# EAGLE design osh4000_breakout (EAGLE 6.6.0)
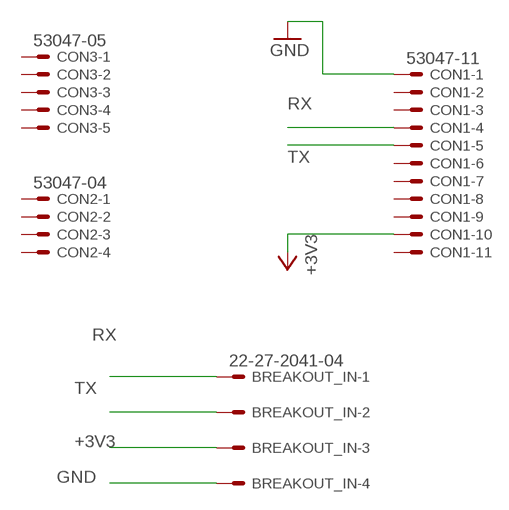
[diagram p0: schematic, sheet 1]

## Parts
BREAKOUT_IN  22-27-2041-04  [6410-04]
CON1  53047-11  [53047-11]
CON2  53047-04  [53047-04]
CON3  53047-05  [53047-05]

## Nets
+3V3: BREAKOUT_IN.3 CON1.10
GND: BREAKOUT_IN.4 CON1.1
RX: BREAKOUT_IN.1 CON1.4
TX: BREAKOUT_IN.2 CON1.5
Unconnected: CON1.2 CON1.3 CON1.6 CON1.7 CON1.8 CON1.9 CON1.11 CON2.1 CON2.2 CON2.3 CON2.4 CON3.1 CON3.2 CON3.3 CON3.4 CON3.5

## Library data of the parts
BREAKOUT_IN = con-molex:22-?-04: CONNECTOR wire to board 2.54 mm (.1 inch) pitch header; OC_FARNELL: unknown; OC_NEWARK: unknown
CON1 = con-molex:53?-11: CONNECTOR wire to board 1.25 mm (.049 inch) pitch header; MF: WALDOM/MOLEX; MPN: 53047-1110; OC_FARNELL: unknown; OC_NEWARK: 18M8168
CON2 = con-molex:53?-04: CONNECTOR wire to board 1.25 mm (.049 inch) pitch header; MF: WALDOM/MOLEX; MPN: 53047-0410; OC_FARNELL: 9733060; OC_NEWARK: 38C9900
CON3 = con-molex:53?-05: CONNECTOR wire to board 1.25 mm (.049 inch) pitch header; MF: MOLEX; MPN: 53047-0510; OC_FARNELL: 9732861; OC_NEWARK: 38C9901

## Net classes
0 default: clearance 0.705 mm

## Board
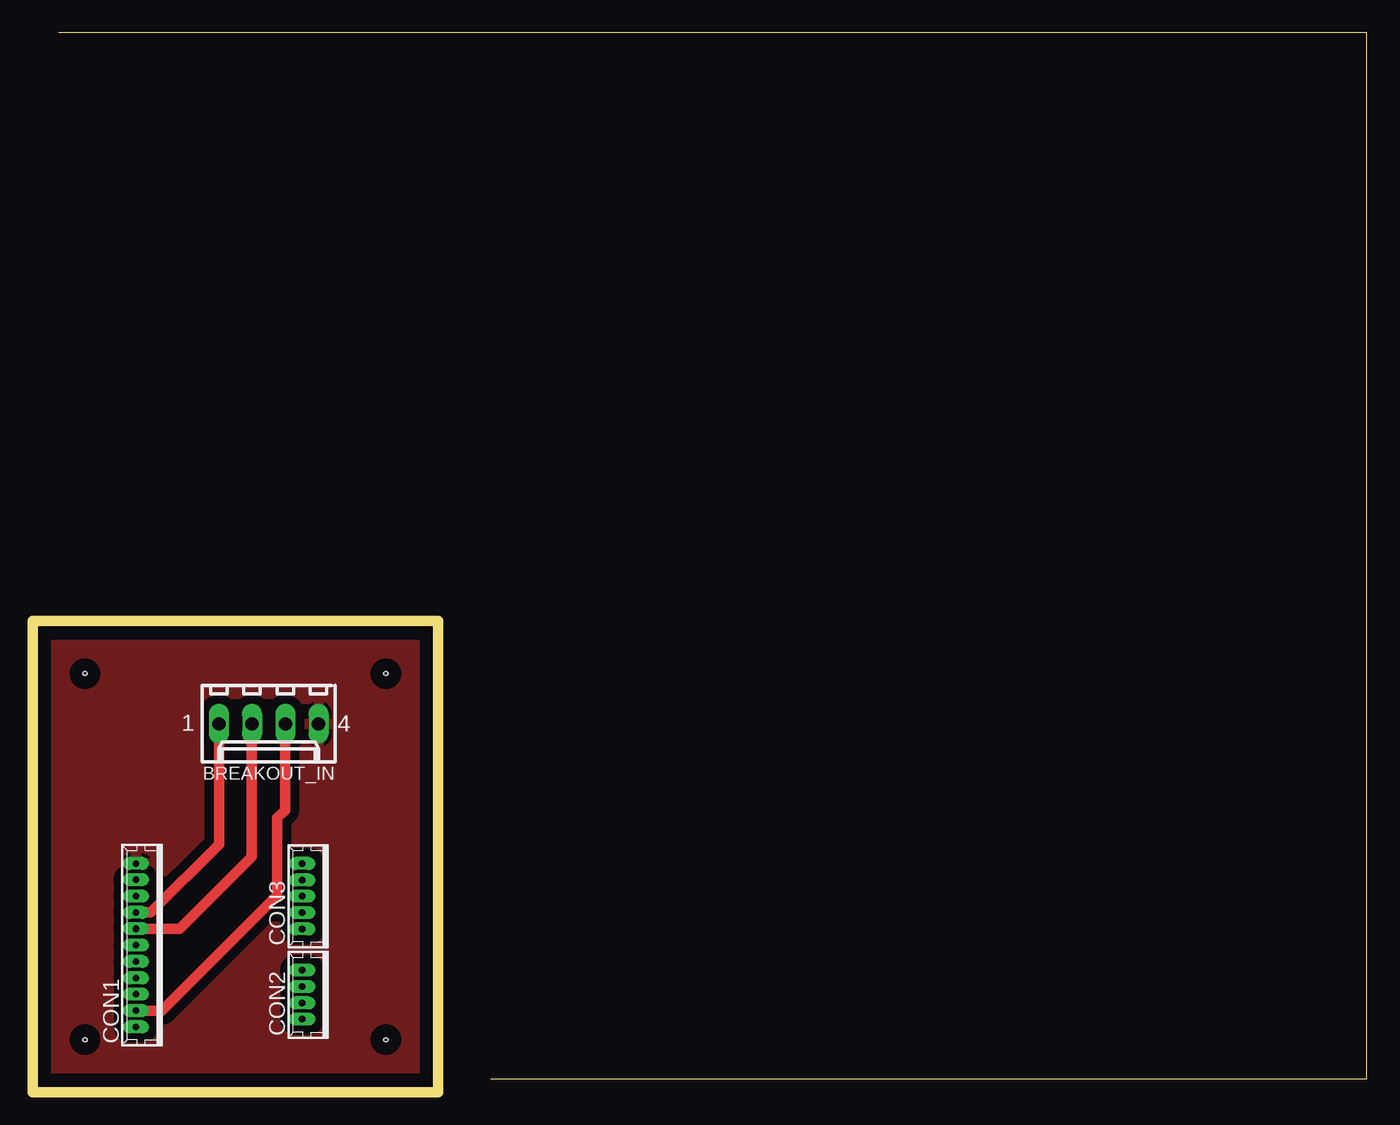
[diagram p1: board, top side]

Size 102 x 81 mm. Coordinates in mm from the lower left corner, seen from the top.
Outline: 35,1 102,1 102,81 2,81
Outline: 0,36 31,36 31,0 0,0 0,36
Copper layers (1*16): Top 0.035mm / dielectric 1.5mm / Bottom 0.035mm
Design rules "osh4000_breakout": minimum track width 10mil, minimum drill 24mil, track to track 0.205mm, track to pad 0.205mm, pad to pad 0.205mm, via to via 0.205mm, smd to smd 8mil, copper to edge 40mil, drill to drill 8mil, minimum pad ring 10mil, minimum via ring 8mil, stop-mask expansion 4mil, vias tented up to drill 0mil, thermal gap 10mil
Holes 0.3 mm at 4,32 27,32 27,4 4,4

### Footprints (pad centres in the part's own frame; a part is rotated, then mirrored left to right if it is on the bottom)
6410-04 = drill 1.016 long: 1 3.81,0; 2 1.27,0; 3 -1.27,0; 4 -3.81,0
53047-11 = drill 0.5 pad 0.698 long: 1 6.25,0.45; 2 5,0.45; 3 3.75,0.45; 4 2.5,0.45; 5 1.25,0.45; 6 0,0.45; 7 -1.25,0.45; 8 -2.5,0.45; 9 -3.75,0.45; 10 -5,0.45; 11 -6.25,0.45
53047-04 = drill 0.5 pad 0.698 long: 1 1.875,0.45; 2 0.625,0.45; 3 -0.625,0.45; 4 -1.875,0.45
53047-05 = drill 0.5 pad 0.698 long: 1 2.5,0.45; 2 1.25,0.45; 3 0,0.45; 4 -1.25,0.45; 5 -2.5,0.45

### Placement (x,y rotation side)
BREAKOUT_IN  18.04,28.15 180 top
CON1  8.35,11.23 90 top
CON2  21.05,7.44 90 top
CON3  21.05,14.97 90 top

### Tracks (layer width: path | path; a pad name or v marks a point on that pad's centre or on a via)
+3V3
  Top 0.813: CON1.10 9.88,6.23 18.7,15.05 18.7,20.95 19.3,21.55 BREAKOUT_IN.3
GND
  pour Top: 0,36 0,0 31,0 31,36
RX
  Top 0.813: CON1.4 9.03,13.73 14.25,18.95 14.25,28.13 BREAKOUT_IN.1
TX
  Top 0.813: CON1.5 11.23,12.48 16.75,18 16.75,28.13 BREAKOUT_IN.2